# EAGLE design carrier_sengi (EAGLE 9.2.2)
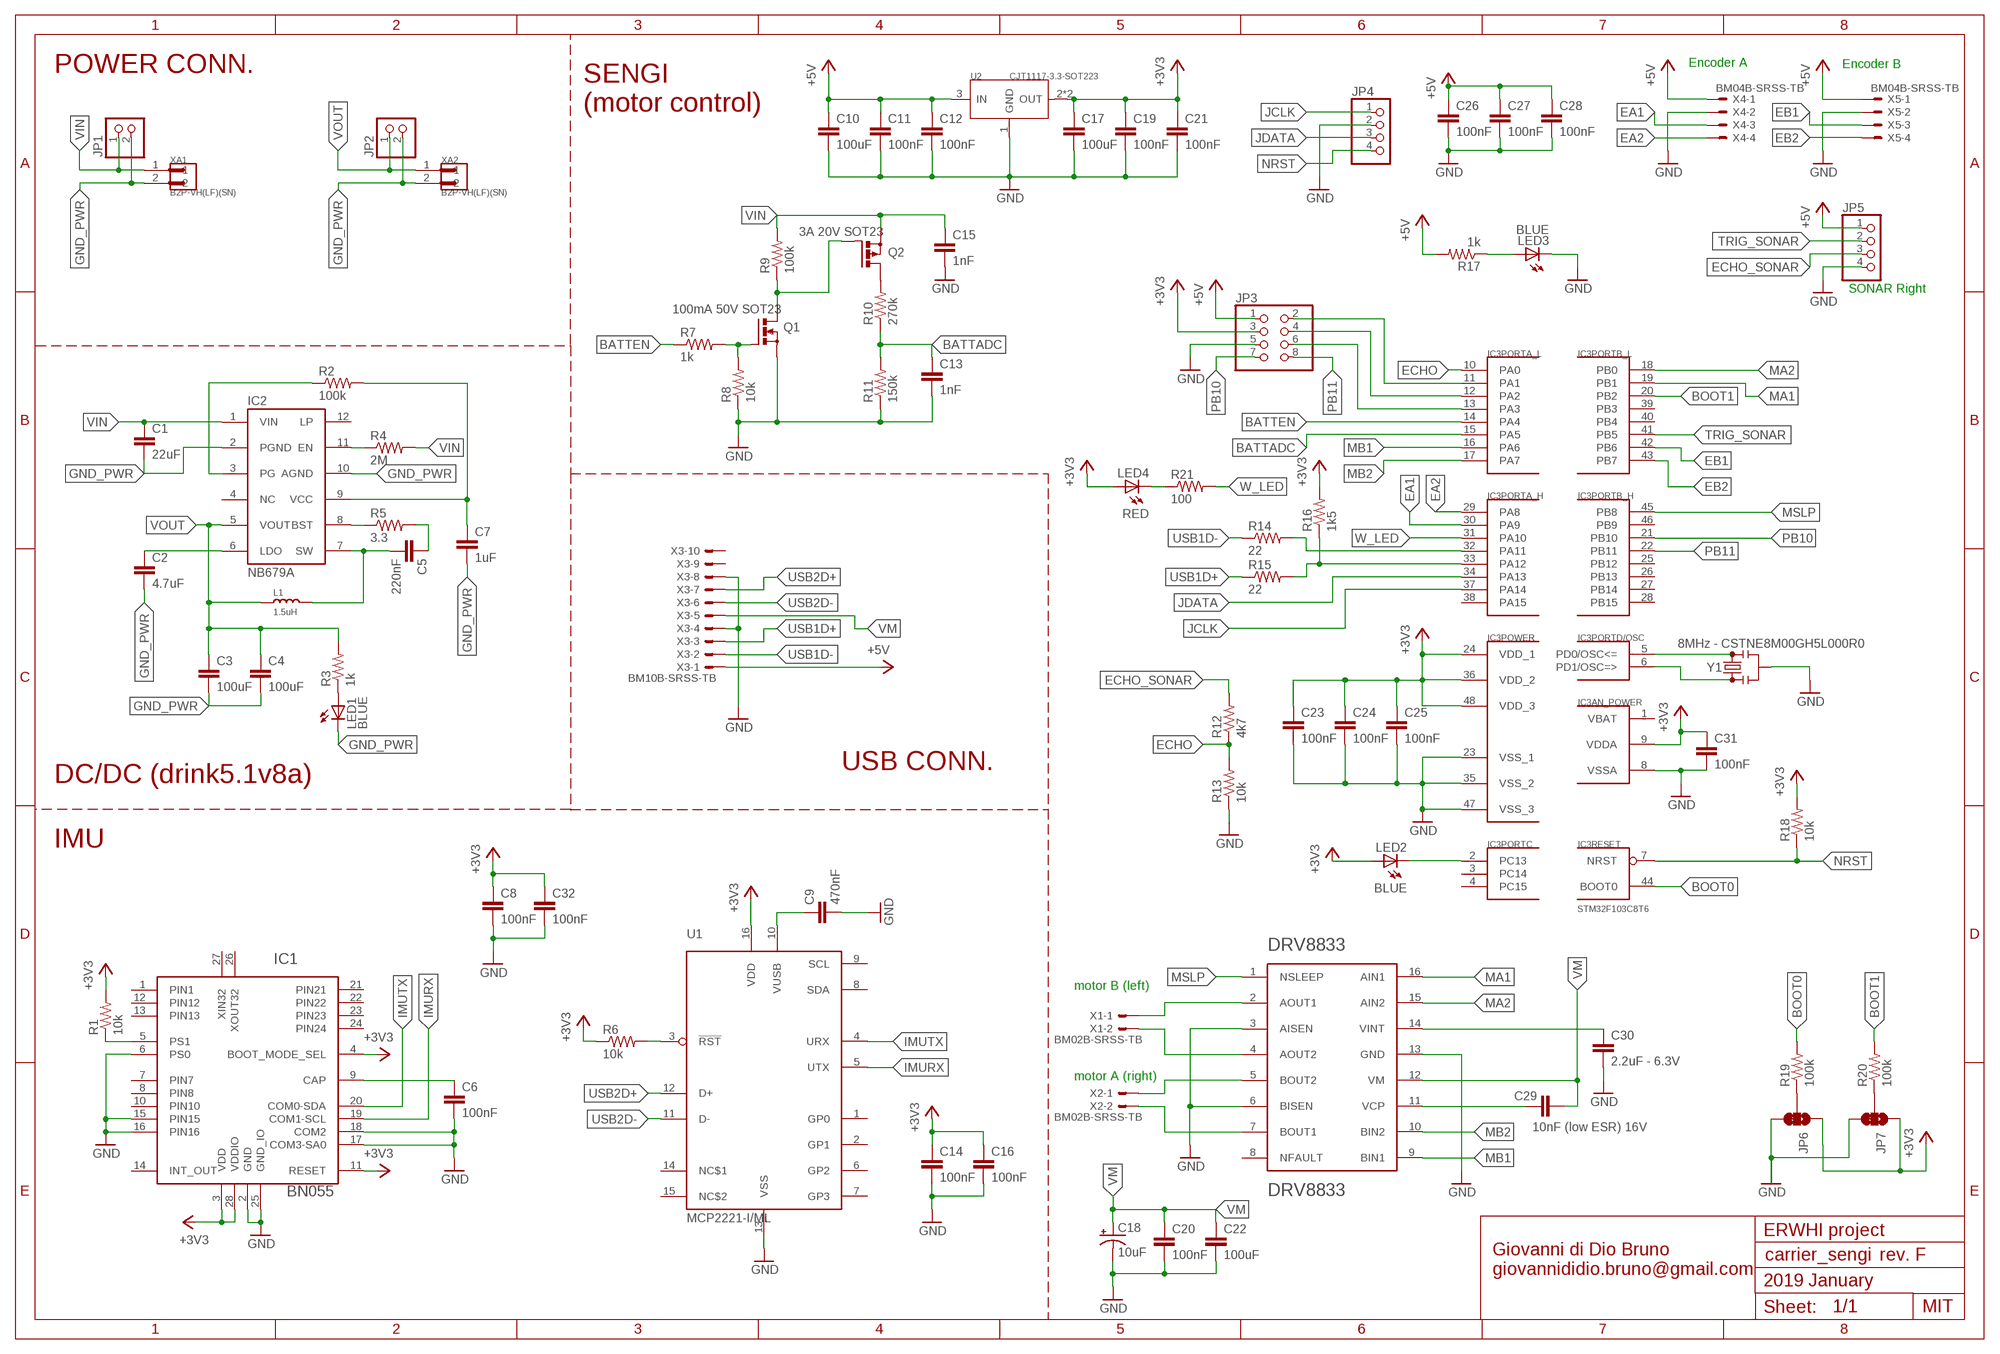
[diagram p0: schematic, sheet 1]

## Parts
C1  22uF  C-EUC0805  [C0805]
C2  4.7uF  C-EUC0603  [C0603]
C3  100uF  C-EUC0805  [C0805]
C4  100uF  C-EUC0805  [C0805]
C5  220nF  C-EUC0603  [C0603]
C6  100nF  C-EUC0402  [C0402]
C7  1uF  C-EUC0603  [C0603]
C8  100nF  C-EUC0402  [C0402]
C9  470nF  C-EUC0402  [C0402]
C10  100uF  C-EUC0603  [C0603]
C11  100nF  C-EUC0402  [C0402]
C12  100nF  C-EUC0402  [C0402]
C13  1nF  C-EUC0402  [C0402]
C14  100nF  C-EUC0402  [C0402]
C15  1nF  C-EUC0402  [C0402]
C16  100nF  C-EUC0402  [C0402]
C17  100uF  C-EUC0603  [C0603]
C18  10uF  10UF-POLAR-EIA3216-16V-10%(TANT)  [EIA3216]
C19  100nF  C-EUC0402  [C0402]
C20  100nF  C-EUC0402  [C0402]
C21  100nF  C-EUC0402  [C0402]
C22  100uF  C-EUC0603  [C0603]
C23  100nF  C-EUC0402  [C0402]
C24  100nF  C-EUC0402  [C0402]
C25  100nF  C-EUC0402  [C0402]
C26  100nF  C-EUC0402  [C0402]
C27  100nF  C-EUC0402  [C0402]
C28  100nF  C-EUC0402  [C0402]
C29  10nF (low ESR) 16V  C-EUC0402  [C0402]
C30  2.2uF - 6.3V  C-EUC0402  [C0402]
C31  100nF  C-EUC0402  [C0402]
C32  100nF  C-EUC0402  [C0402]
IC1  BN055  1658_BNO055  [LGA-28_3.80X5.20/0.5]
IC2  NB679A  [QFN12_2X3]
IC3  STM32F103C8T6  STM32F10XCXT6  [TQFP48]
IC4  DRV8833PWP  DRV8833  [SOP65P640X120-17N]
JP1  PINHD-1X2  [1X02]
JP2  PINHD-1X2  [1X02]
JP3  PINHD-2X4  [2X04]
JP4  PINHD-1X4  [1X04]
JP5  PINHD-1X4  [1X04]
JP6  JUMPER-SMT_3_1-NC_TRACE_NO-SILK  [SMT-JUMPER_3_1-NC_TRACE_NO-SILK]
JP7  JUMPER-SMT_3_1-NC_TRACE_NO-SILK  [SMT-JUMPER_3_1-NC_TRACE_NO-SILK]
L1  1.5uH  SMD-INDUCTOR-10UH-20%(2P-6X6MM)'0630'  [SMD-2P-L6.0XW6.0XH3.0MM]
LED1  BLUE  LEDCHIP-LED0603  [CHIP-LED0603]
LED2  BLUE  LEDCHIP-LED0603  [CHIP-LED0603]
LED3  BLUE  LEDCHIP-LED0603  [CHIP-LED0603]
LED4  RED  LEDCHIP-LED0603  [CHIP-LED0603]
Q1  100mA 50V SOT23  IRLML6344  [SOT-23]
Q2  3A 20V SOT23  IRLML6402  [SOT-23]
R1  10k  R-US_R0402  [R0402]
R2  100k  R-US_R0402  [R0402]
R3  1k  R-US_R0402  [R0402]
R4  2M  R-US_R0603  [R0603]
R5  3.3  R-US_R0603  [R0603]
R6  10k  R-US_R0402  [R0402]
R7  1k  R-US_R0402  [R0402]
R8  10k  R-US_R0402  [R0402]
R9  100k  R-US_R0402  [R0402]
R10  270k  R-US_R0402  [R0402]
R11  150k  R-US_R0402  [R0402]
R12  4k7  R-US_R0402  [R0402]
R13  10k  R-US_R0402  [R0402]
R14  22  R-US_R0402  [R0402]
R15  22  R-US_R0402  [R0402]
R16  1k5  R-US_R0402  [R0402]
R17  1k  R-US_R0402  [R0402]
R18  10k  R-US_R0402  [R0402]
R19  100k  R-US_R0402  [R0402]
R20  100k  R-US_R0402  [R0402]
R21  100  R-US_R0402  [R0402]
U1  MCP2221-I/ML  [QFN16-4X4]
U2  CJT1117-3.3-SOT223  PMIC-CJT1117-3.3(SOT223)  [SOT-223]
X1  BM02B-SRSS-TB  [BM02B-SRSS-TB]
X2  BM02B-SRSS-TB  [BM02B-SRSS-TB]
X3  BM10B-SRSS-TB  [BM10B-SRSS-TB]
X4  BM04B-SRSS-TB  [BM04B-SRSS-TB]
X5  BM04B-SRSS-TB  [BM04B-SRSS-TB]
XA1  B2P-VH(LF)(SN)  [JST_B2P-VH(LF)(SN)]
XA2  B2P-VH(LF)(SN)  [JST_B2P-VH(LF)(SN)]
Y1  8MHz - CSTNE8M00GH5L000R0  RESONATOR-8MHZSMD_3.2X1.3  [RESONATOR-SMD-3.2X1.3]

## Nets
+3V3: C8.1 C14.1 C16.1 C17.1 C19.1 C21.1 C23.1 C24.1 C25.1 C31.1 C32.1 IC1.3(VDD) IC1.4(BOOT_MODE_SEL) IC1.11(RESET) IC1.28(VDDIO) IC3.9(AN_POWER:VDDA) IC3.24(POWER:VDD_1) IC3.36(POWER:VDD_2) IC3.48(POWER:VDD_3) JP3.3 JP6.1 JP7.1 LED2.A LED4.A R1.2 R6.1 R16.2 R18.2 U1.16(VDD) U2.2(OUT) U2.TER(OUT)
+5V: C10.1 C11.1 C12.1 C26.1 C27.1 C28.1 JP3.1 JP5.1 R17.2 U2.3(IN) X3.1 X4.1 X5.1
BATTADC: C13.1 IC3.15(PORTA_L:PA5) R10.1 R11.2
BATTEN: IC3.14(PORTA_L:PA4) R7.1
BOOT0: IC3.44(RESET:BOOT0) R19.2
BOOT1: IC3.20(PORTB_L:PB2) R20.2
EA1: IC3.30(PORTA_H:PA9) X4.3
EA2: IC3.29(PORTA_H:PA8) X4.4
EB1: IC3.42(PORTB_L:PB6) X5.3
EB2: IC3.43(PORTB_L:PB7) X5.4
ECHO: IC3.10(PORTA_L:PA0) R12.1 R13.2
ECHO_SONAR: JP5.3 R12.2
GND: C6.2 C8.2 C9.2 C10.2 C11.2 C12.2 C13.2 C14.2 C15.2 C16.2 C17.2 C18.- C19.2 C20.2 C21.2 C22.2 C23.2 C24.2 C25.2 C26.2 C27.2 C28.2 C30.2 C31.2 C32.2 IC1.2(GND) IC1.6(PS0) IC1.15(PIN15) IC1.16(PIN16) IC1.17(COM3-SA0) IC1.18(COM2) IC1.25(GND_IO) IC3.8(AN_POWER:VSSA) IC3.23(POWER:VSS_1) IC3.35(POWER:VSS_2) IC3.47(POWER:VSS_3) IC4.3(AISEN) IC4.6(BISEN) IC4.13(GND) JP3.5 JP4.2 JP5.4 JP6.3 JP7.3 LED3.C Q1.P2(S) R8.1 R11.1 R13.1 U1.13(VSS) U2.1(GND) X3.4 X3.8 X4.2 X5.2 Y1.2
GND_PWR: C1.2 C2.2 C3.2 C4.2 C7.2 IC2.2(PGND) IC2.10(AGND) JP1.2 JP2.2 LED1.C XA1.2 XA2.2
IMURX: IC1.19(COM1-SCL) U1.5(UTX)
IMUTX: IC1.20(COM0-SDA) U1.4(URX)
JCLK: IC3.37(PORTA_H:PA14) JP4.1
JDATA: IC3.34(PORTA_H:PA13) JP4.3
MA1: IC3.19(PORTB_L:PB1) IC4.16(AIN1)
MA2: IC3.18(PORTB_L:PB0) IC4.15(AIN2)
MB1: IC3.16(PORTA_L:PA6) IC4.9(BIN1)
MB2: IC3.17(PORTA_L:PA7) IC4.10(BIN2)
MSLP: IC3.45(PORTB_H:PB8) IC4.1(NSLEEP)
N$1: IC3.5(PORTD/OSC:PD0/OSC<=) Y1.3
N$2: IC3.6(PORTD/OSC:PD1/OSC=>) Y1.1
N$3: JP6.2 R19.1
N$4: LED4.C R21.1
N$5: IC3.32(PORTA_H:PA11) R14.2
N$6: IC3.33(PORTA_H:PA12) R15.2 R16.1
N$7: JP7.2 R20.1
N$8: IC3.2(PORTC:PC13) LED2.C
N$9: IC4.2(AOUT1) X1.1
N$11: IC4.4(AOUT2) X1.2
N$12: IC4.5(BOUT2) X2.1
N$13: IC4.7(BOUT1) X2.2
N$14: C30.1 IC4.14(VINT)
N$15: C29.2 IC4.11(VCP)
N$16: LED3.A R17.1
N$17: IC3.11(PORTA_L:PA1) JP3.2
N$18: IC3.12(PORTA_L:PA2) JP3.4
N$19: IC3.13(PORTA_L:PA3) JP3.6
N$20: C6.1 IC1.9(CAP)
N$21: IC1.5(PS1) R1.1
N$23: C9.1 U1.10(VUSB)
N$26: R6.2 U1.3(!RST)
N$27: IC2.11(EN) R4.1
N$28: IC2.3(PG) R2.1
N$29: C2.1 IC2.6(LDO)
N$30: IC2.8(BST) R5.1
N$31: C5.1 R5.2
N$32: C5.2 IC2.7(SW) L1.2
N$33: C7.1 IC2.9(VCC) R2.2
N$37: LED1.A R3.1
N$40: Q1.P1(G) R7.2 R8.2
N$41: Q2.P3(D) R10.2
N$46: Q1.P3(D) Q2.P1(G) R9.1
NRST: IC3.7(RESET:NRST) JP4.4 R18.1
PB10: IC3.21(PORTB_H:PB10) JP3.7
PB11: IC3.22(PORTB_H:PB11) JP3.8
TRIG_SONAR: IC3.41(PORTB_L:PB5) JP5.2
USB1D+: R15.1 X3.3
USB1D-: R14.1 X3.2
USB2D+: U1.12(D+) X3.7
USB2D-: U1.11(D-) X3.6
VIN: C1.1 C15.1 IC2.1(VIN) JP1.1 Q2.P2(S) R4.2 R9.2 XA1.1
VM: C18.+ C20.1 C22.1 C29.1 IC4.12(VM) X3.5
VOUT: C3.1 C4.1 IC2.5(VOUT) JP2.1 L1.1 R3.2 XA2.1
W_LED: IC3.31(PORTA_H:PA10) R21.2
Unconnected: IC1.1(PIN1) IC1.7(PIN7) IC1.8(PIN8) IC1.10(PIN10) IC1.12(PIN12) IC1.13(PIN13) IC1.14(INT_OUT) IC1.21(PIN21) IC1.22(PIN22) IC1.23(PIN23) IC1.24(PIN24) IC1.26(XOUT32) IC1.27(XIN32) IC2.4(NC) IC2.12(LP) IC3.3(PORTC:PC14) IC3.4(PORTC:PC15) IC3.25(PORTB_H:PB12) IC3.26(PORTB_H:PB13) IC3.27(PORTB_H:PB14) IC3.28(PORTB_H:PB15) IC3.38(PORTA_H:PA15) IC3.39(PORTB_L:PB3) IC3.40(PORTB_L:PB4) IC3.46(PORTB_H:PB9) IC4.8(NFAULT) U1.1(GP0) U1.2(GP1) U1.6(GP2) U1.7(GP3) U1.8(SDA) U1.9(SCL) U1.14(NC$1) U1.15(NC$2) X3.9 X3.10

## Notes on the sheet
- Encoder A | Encoder B
- POWER CONN.
- SENGI
  (motor control)
- SONAR Right
- USB CONN.
- DC/DC (drink5.1v8a)
- IMU
- motor B (left)
- motor A (right)
- ERWHI project
- rev. F
- Giovanni di Dio Bruno
  giovannididio.bruno@gmail.com
- 2019 January
- MIT

## Power pins joined to a net without a drawn wire
VBAT: IC3.1(AN_POWER:VBAT)

## Library data of the parts
C1-C17 C19-C32 = resistor:C-EU: CAPACITOR, European symbol
C18 = SparkFun-Capacitors:10UF-POLAR: 10.0µF polarized capacitors A capacitor is a passive two-terminal electrical component used to store electrical energy temporarily in an electric field.; PROD_ID: CAP-00811
IC1 = BNO055:1658_BNO055: BN055 Intelligent 9-axis absolute orientation sensor; PART_NUMBER: BNO055
IC2 = my03:NB679A: NB679A 5.1V 8A step down
IC3 = stm32:STM32F10XCXT6: ST STM32F101/103 48pin LQFP
IC4 = DRV8833PWP:DRV8833
JP1 JP2 = pinhead:PINHD-1X2: PIN HEADER
JP3 = pinhead:PINHD-2X4: PIN HEADER
JP4 JP5 = pinhead:PINHD-1X4: PIN HEADER
JP6 JP7 = SparkFun-Jumpers:JUMPER-SMT_3_1-NC_TRACE: Normally closed trace jumper (1 of 2 connections) This jumper has a trace between two pads so it's normally closed (NC). The other connection is normally open (NO). Use a razor knife to open the connection. For best results follow the IPC guidelines for cutting traces: Cutout at least 0.063 mm (0.005 in). Remove all loose material to clean up the cut area. Seal the cut with an approved epoxy. Reapply solder to reclose the connection, or to close the NO connection.
L1 = Seeed-Inductor:SMD-INDUCTOR-10UH-20%(2P-6X6MM): 303010016; MPN: CSAB0630-100M; VALUE: 10UH
LED1-LED4 = led:LED: LED OSRAM: - CHIPLED LG R971, LG N971, LY N971, LG Q971, LY Q971, LO R971, LY R971 LH N974, LH R974 LS Q976, LO Q976, LY Q976 LO Q996 - Hyper CHIPLED LW Q18S LB Q993, LB Q99A, LB R99A - SideLED LS A670, LO A670, LY A670, LG A670, LP A670 LB A673, LV A673, LT A673, LW A673 LH A674 LY A675 LS A676, LA A676, LO A676, LY A676, LW A676 LS A679, LY A679, LG A679 - Hyper Micro SIDELED® LS Y876, LA Y876, LO Y876, LY Y876 LT Y87S - SmartLED LW L88C, LW L88S LB L89C, LB L89S, LG L890 LS L89K, LO L89K, LY L89K LS L896, LA L896, LO L896, LY L896 - TOPLED LS T670, LO T670, LY T670, LG T670, LP T670 LSG T670, LSP T670, LSY T670, LOP T670, LYG T670 LG T671, LOG T671, LSG T671 LB T673, LV T673, LT T673, LW T673 LH T674 LS T676, LA T676, LO T676, LY T676, LB T676, LH T676, LSB T676, LW T676 LB T67C, LV T67C, LT T67C, LS T67K, LO T67K, LY T67K, LW E67C LS E67B, LA E67B, LO E67B, LY E67B, LB E67C, LV E67C, LT E67C LW T67C LS T679, LY T679, LG T679 LS T770, LO T770, LY T770, LG T770, LP T770 LB T773, LV T773, LT T773, LW T773 LH T774 LS E675, LA E675, LY E675, LS T675 LS T776, LA T776, LO T776, LY T776, LB T776 LHGB T686 LT T68C, LB T68C - Hyper Mini TOPLED® LB M676 - Mini TOPLED Santana® LG M470 LS M47K, LO M47K, LY M47K Source: http://www.osram.convergy.de LUXEON: - LUMILED® LXK2-PW12-R00, LXK2-PW12-S00, LXK2-PW14-U00, LXK2-PW14-V00 LXK2-PM12-R00, LXK2-PM12-S00, LXK2-PM14-U00 LXK2-PE12-Q00, LXK2-PE12-R00, LXK2-PE12-S00, LXK2-PE14-T00, LXK2-PE14-U00 LXK2-PB12-K00, LXK2-PB12-L00, LXK2-PB12-M00, LXK2-PB14-N00, LXK2-PB14-P00, LXK2-PB14-Q00 LXK2-PR12-L00, LXK2-PR12-M00, LXK2-PR14-Q00, LXK2-PR14-R00 LXK2-PD12-Q00, LXK2-PD12-R00, LXK2-PD12-S00 LXK2-PH12-R00, LXK2-PH12-S00 LXK2-PL12-P00, LXK2-PL12-Q00, LXK2-PL12-R00 Source: www.luxeon.com KINGBRIGHT: KA-3528ASYC Source: www.kingbright.com
Q1 = mosfet:IRLML6344: Nch MOSFET IRLML6344 30V 5A http://akizukidenshi.com/catalog/g/gI-06049/ I-06049
Q2 = mosfet:IRLML6402: Pch MOSFET IRLML6402 20V 3.7A http://akizukidenshi.com/catalog/g/gI-02553/ I-02553
R1-R21 = resistor:R-US_: RESISTOR, American symbol
U1 = microchip-mcp2221:MCP2221-I/ML: MCP2221 in QFN package The MCP2221 is a USB-to-UART/I2C serial converter which enables USB connectivity in applications that have a UART and I2C interfaces. The device reduces external components by integrating the USB termination resistors and the oscillator needed for USB operation. The MCP2221 also has four GP pins providing miscellaneous functionalities (GPIO, USBCFG, SSPND, Clock Output, ADC, DAC, interrupt detector). Source: www.microchip.com/MCP2221 <http://www.microchip.com/wwwproducts/Devices.aspx?product=MCP2221> and www.microchipdirect.com <http://www.microchipdirect.com/ProductDetails.aspx?Category=MCP2221> Tutorial: MCP2221 by Arnauld Biganzoli <https://docs.google.com/document/d/1P3zzqCKdEXzCe--1Yyg8PClCZKsUri8pyNO7AV2daaw/edit?usp=sharing>
U2 = Seeed-IC:PMIC-CJT1117-3.3(SOT223): 310030097; MPN: CJT1117-3.3
X1 X2 = con-jst2:?M02B-SRSS-TB: Disconnectable Crimp style connector, 1.0mm pitch 2 contacts
X3 = con-jst2:?M10B-SRSS-TB: Disconnectable Crimp style connector, 1.0mm pitch 10 contacts
X4 X5 = con-jst2:?M04B-SRSS-TB: Disconnectable Crimp style connector, 1.0mm pitch 4 contacts
XA1 XA2 = B2P-VH_LF__SN_:B2P-VH(LF)(SN): VH Series 3.96 mm Pitch, Compact, Lock Mechanism also Prevents Misinsertion; AVAILABILITY: Good; DESCRIPTION: VH Series 3.96 mm Pitch, Compact, Lock Mechanism also Prevents Misinsertion; MF: JST; MP: B2P-VH_LF__SN_; PACKAGE: FakePackage u; PRICE: 0.09 USD
Y1 = SparkFun-Clocks:RESONATOR-8MHZ: 8MHz Resonator Digikey Example <http://www.digikey.com/product-detail/en/murata-electronics-north-america/CSTCE10M0G55-R0/490-1196-1-ND/584633> Frequency: 8MHz Frequency Stability: ±0.2% Frequency Tolerance: ±0.5% Capacitance: 33pF SparkFun Products Arduino Pro Mini 328- 3.3V/8MHz <https://www.sparkfun.com/products/11114> SparkFun Digital Sandbox <https://www.sparkfun.com/products/12651>; PROD_ID: XTAL-08895; VALUE: 8MHz

## Board
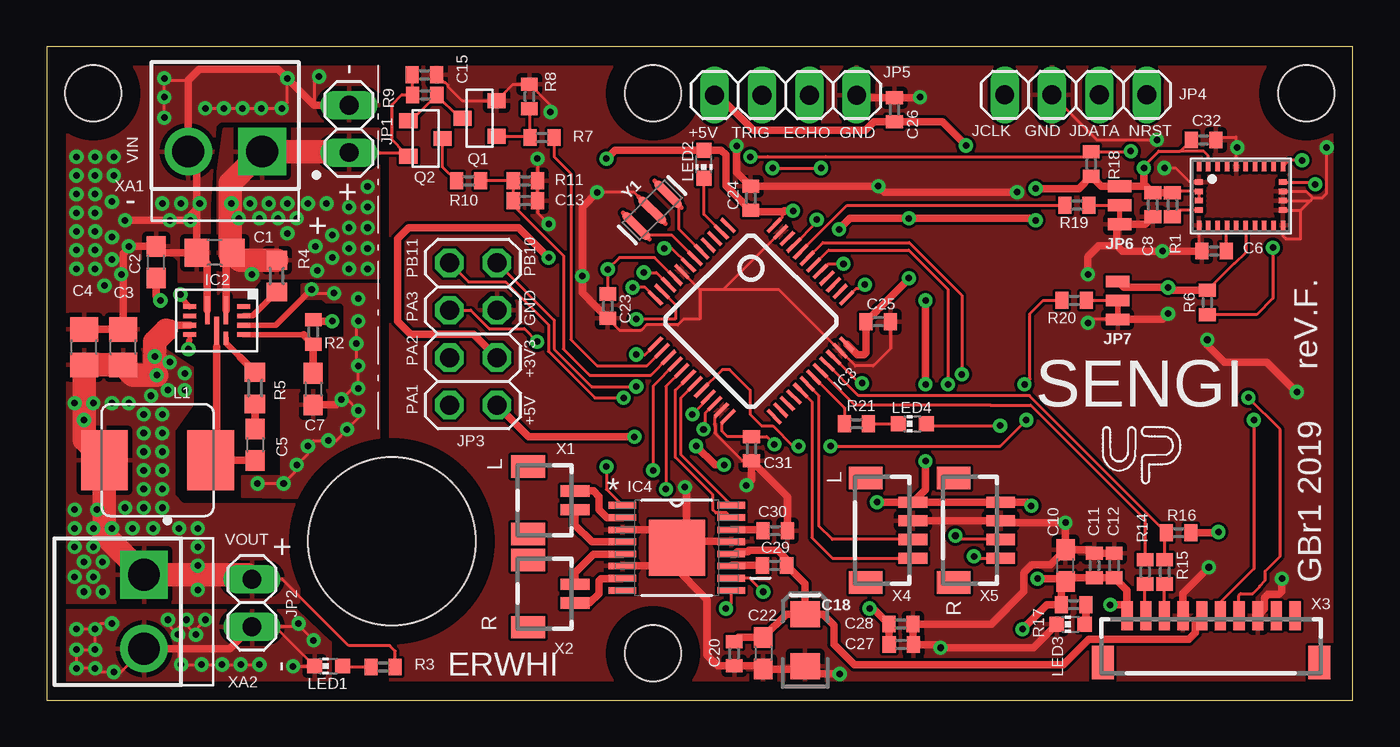
[diagram p1: board, top side]
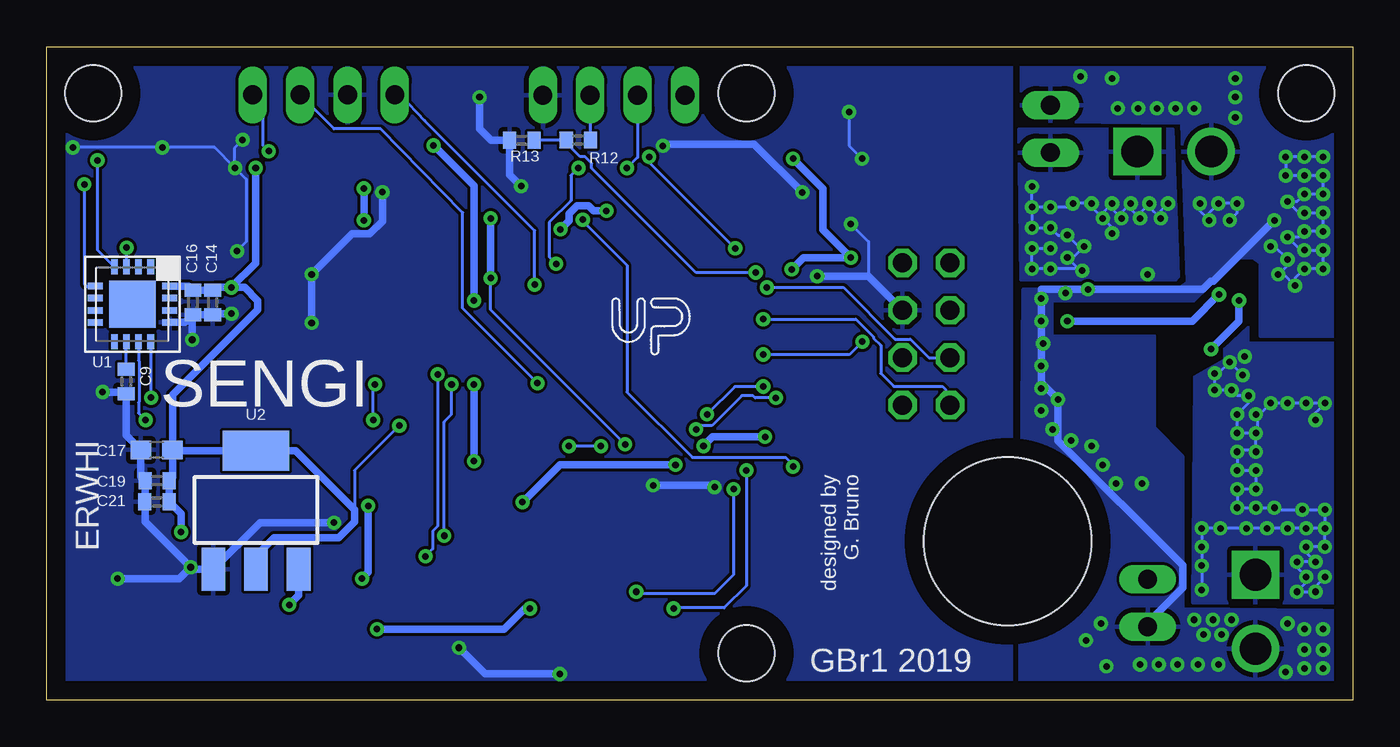
[diagram p2: board, bottom side, seen from below]

Size 70 x 35 mm. Coordinates in mm from the lower left corner, seen from the top.
Outline: 0,0 70,0 70,35 0,35 0,0
Copper layers (1*16): Top 0.035mm / dielectric 1.5mm / Bottom 0.035mm
Design rules "default": minimum track width 6mil, minimum drill 0.35mm, track to track 6mil, track to pad 6mil, pad to pad 6mil, via to via 6mil, smd to smd 6mil, copper to edge 40mil, drill to drill 6mil, minimum pad ring 10mil, minimum via ring 8mil, stop-mask expansion 4mil, vias tented up to drill 0mil, thermal gap 10mil
Holes 3 mm at 32.5,2.5 67.5,32.5 32.5,32.5 2.5,32.5
Holes 9 mm at 18.5,8.5

### Footprints (pad centres in the part's own frame; a part is rotated, then mirrored left to right if it is on the bottom)
C0805 = smd 1.3 x 1.5: 1 -0.95,0; 2 0.95,0
C0603 = smd 1.1 x 1: 1 -0.85,0; 2 0.85,0
C0402 = smd 0.7 x 0.9: 1 -0.65,0; 2 0.65,0
EIA3216 = smd 1.4 x 1.6: + 1.4,0; - -1.4,0
LGA-28_3.80X5.20/0.5 = smd 0.3 x 0.5: 1 -2.25,1.56; 6 -2.25,-1.56; 7 -1.75,-1.56; 8 -1.25,-1.56; 9 -0.75,-1.56; 10 -0.25,-1.56; 11 0.25,-1.56; 12 0.75,-1.56; 13 1.25,-1.56; 14 1.75,-1.56; 15 2.25,-1.56; 20 2.25,1.56; 21 1.75,1.56; 22 1.25,1.56; 23 0.75,1.56; 24 0.25,1.56; 25 -0.25,1.56; 26 -0.75,1.56; 27 -1.25,1.56; 28 -1.75,1.56 | smd 0.5 x 0.3: 2 -2.25,0.75; 3 -2.25,0.25; 4 -2.25,-0.25; 5 -2.25,-0.75; 16 2.25,-0.75; 17 2.25,-0.25; 18 2.25,0.25; 19 2.25,0.75
QFN12_2X3 = smd 1.5 x 0.25: 1 -0.55,0.5; 2 -0.55,-0.5; 7 0.55,0 | smd 0.25 x 0.7: 3 -0.75,-1.45; 4 -0.25,-1.45; 5 0.25,-1.45; 6 0.75,-1.45; 9 0.75,1.45; 10 0.25,1.45; 11 -0.25,1.45; 12 -0.75,1.45 | smd 0.7 x 0.25: 8 0.95,0.5
TQFP48 = smd 0.2 x 1: 1 -2.75,-4.5; 2 -2.25,-4.5; 3 -1.75,-4.5; 4 -1.25,-4.5; 5 -0.75,-4.5; 6 -0.25,-4.5; 7 0.25,-4.5; 8 0.75,-4.5; 9 1.25,-4.5; 10 1.75,-4.5; 11 2.25,-4.5; 12 2.75,-4.5; 25 2.75,4.5; 26 2.25,4.5; 27 1.75,4.5; 28 1.25,4.5; 29 0.75,4.5; 30 0.25,4.5; 31 -0.25,4.5; 32 -0.75,4.5; 33 -1.25,4.5; 34 -1.75,4.5; 35 -2.25,4.5; 36 -2.75,4.5 | smd 1 x 0.2: 13 4.5,-2.75; 14 4.5,-2.25; 15 4.5,-1.75; 16 4.5,-1.25; 17 4.5,-0.75; 18 4.5,-0.25; 19 4.5,0.25; 20 4.5,0.75; 21 4.5,1.25; 22 4.5,1.75; 23 4.5,2.25; 24 4.5,2.75; 37 -4.5,2.75; 38 -4.5,2.25; 39 -4.5,1.75; 40 -4.5,1.25; 41 -4.5,0.75; 42 -4.5,0.25; 43 -4.5,-0.25; 44 -4.5,-0.75; 45 -4.5,-1.25; 46 -4.5,-1.75; 47 -4.5,-2.25; 48 -4.5,-2.75
SOP65P640X120-17N = smd 1.473 x 0.356: 1 -2.921,2.286; 2 -2.921,1.626; 3 -2.921,0.965; 4 -2.921,0.33; 5 -2.921,-0.33; 6 -2.921,-0.965; 7 -2.921,-1.626; 8 -2.921,-2.286; 9 2.921,-2.286; 10 2.921,-1.626; 11 2.921,-0.965; 12 2.921,-0.33; 13 2.921,0.33; 14 2.921,0.965; 15 2.921,1.626; 16 2.921,2.286 | smd 2.997 x 2.997: 17 0,0
1X02 = drill 1.016 long: 1 -1.27,0; 2 1.27,0
2X04 = drill 1.016 octagon: 1 -3.81,-1.27; 2 -3.81,1.27; 3 -1.27,-1.27; 4 -1.27,1.27; 5 1.27,-1.27; 6 1.27,1.27; 7 3.81,-1.27; 8 3.81,1.27
1X04 = drill 1.016 long: 1 -3.81,0; 2 -1.27,0; 3 1.27,0; 4 3.81,0
SMT-JUMPER_3_1-NC_TRACE_NO-SILK = smd 0.635 x 1.27: 1 -1.016,0; 2 0,0; 3 1.016,0
SMD-2P-L6.0XW6.0XH3.0MM = smd 2.5 x 3.2: 1 -2.85,0; 2 2.85,0
CHIP-LED0603 = smd 0.8 x 0.8: A 0,-0.75; C 0,0.75
SOT-23 = smd 0.802 x 0.972: P1 -0.95,-0.917; P2 0.95,-0.917; P3 0,0.917
R0402 = smd 0.7 x 0.9: 1 -0.65,0; 2 0.65,0
R0603 = smd 1 x 1.1: 1 -0.85,0; 2 0.85,0
QFN16-4X4 = smd 0.8 x 0.35: 1 -2,0.975; 2 -2,0.325; 3 -2,-0.325; 4 -2,-0.975; 9 2,-0.975; 10 2,-0.325; 11 2,0.325; 12 2,0.975 | smd 0.35 x 0.8: 5 -0.975,-2; 6 -0.325,-2; 7 0.325,-2; 8 0.975,-2; 13 0.975,2; 14 0.325,2; 15 -0.325,2; 16 -0.975,2 | smd 2.5 x 2.5: EXP 0,0
SOT-223 = smd 1.27 x 2.286: 1 -2.286,-3.175; 2 0,-3.175; 3 2.286,-3.175 | smd 3.556 x 2.159: TER 0,3.175
BM02B-SRSS-TB = smd 0.6 x 1.55: 1 0.5,-1.625; 2 -0.5,-1.625 | smd 1.2 x 1.8: FIT@1 1.8,0.9; FIT@2 -1.8,0.9
BM10B-SRSS-TB = smd 0.6 x 1.55: 1 4.5,-1.625; 2 3.5,-1.625; 3 2.5,-1.625; 4 1.5,-1.625; 5 0.5,-1.625; 6 -0.5,-1.625; 7 -1.5,-1.625; 8 -2.5,-1.625; 9 -3.5,-1.625; 10 -4.5,-1.625 | smd 1.2 x 1.8: FIT@1 5.8,0.9; FIT@2 -5.8,0.9
BM04B-SRSS-TB = smd 0.6 x 1.55: 1 1.5,-1.625; 2 0.5,-1.625; 3 -0.5,-1.625; 4 -1.5,-1.625 | smd 1.2 x 1.8: FIT@1 2.8,0.9; FIT@2 -2.8,0.9
JST_B2P-VH(LF)(SN) = drill 1.7 square: 1 -1.98,0 | drill 1.7: 2 1.98,0
RESONATOR-SMD-3.2X1.3 = smd 0.45 x 1.905: 1 -1.2,0; 2 0,0; 3 1.2,0

### Placement (x,y rotation side)
C1  9,23.97 180 top
C2  5.87,23.45 90 top
C3  4.1,18.9 90 top
C4  2,18.9 90 top
C5  11.17,13.68 270 top
C6  62.56,24.05 180 top
C7  14.29,16.65 270 top
C8  59.27,26.53 270 top
C9  65.73,17.06 270 bottom
C10  54.6,7.2 90 top
C11  56.15,7.21 90 top
C12  57.21,7.21 90 top
C13  25.66,26.75 0 top
C14  61.1,21.3 270 bottom
C15  20.24,33.49 0 top
C16  62.16,21.3 270 bottom
C17  64.1,13.4 180 bottom
C18  40.65,3.2 90 top
C19  64.08,11.75 180 bottom
C20  36.85,2.48 270 top
C21  64.09,10.61 180 bottom
C22  38.4,2.5 270 top
C23  30.07,21.1 270 top
C24  37.73,26.88 90 top
C25  44.56,20.27 0 top
C26  45.43,31.62 90 top
C27  45.8,2.97 0 top
C28  45.78,4.07 0 top
C29  39.01,7.21 180 top
C30  39.04,9.07 0 top
C31  37.77,13.46 270 top
C32  62,30 0 top
IC1  64,27 0 top
IC2  9.11,20.33 270 top
IC3  37.75,20.3 225 top
IC4  33.77,8.15 0 top
JP1  16.2,30.6 90 top
JP2  11,5.2 270 top
JP3  22.86,19.61 90 top
JP4  55.15,32.42 0 top
JP5  39.6,32.4 0 top
JP6  57.5,26.5 270 top
JP7  57.4,21.4 270 top
L1  5.94,12.85 0 top
LED1  15.1,1.82 90 top
LED2  35.22,28.7 180 top
LED3  54.88,4.06 90 top
LED4  46.4,14.8 90 top
Q1  23.2,31.16 90 top
Q2  20.3,30.08 270 top
R1  60.33,26.53 90 top
R2  14.29,19.71 270 top
R3  18.03,1.77 0 top
R4  12.33,22.71 90 top
R5  11.17,16.71 270 top
R6  62.2,21.3 270 top
R7  26.55,30.13 180 top
R8  25.87,32.33 270 top
R9  20.26,32.41 180 top
R10  22.61,27.81 180 top
R11  25.66,27.81 180 top
R12  41.5,30 0 bottom
R13  44.54,29.99 0 bottom
R14  58.86,6.86 90 top
R15  59.91,6.86 90 top
R16  60.66,8.96 0 top
R17  55.04,5.1 180 top
R18  55.97,28.71 270 top
R19  55.21,26.51 180 top
R20  55.06,21.41 180 top
R21  43.4,14.8 180 top
U1  65.4,21.2 270 bottom
U2  58.78,10.18 0 bottom
U$1  [LOGO_UP]  56.6,11.4 0 top
U$2  [LOGO_UP]  39.7,18.3 0 bottom
X1  26.7,10.7 90 top
X2  26.7,5.7 90 top
X3  62.4,2.9 180 top
X4  44.8,9.1 90 top
X5  49.5,9.1 90 top
XA1  9.57,29.38 180 top
XA2  5.22,4.73 270 top
Y1  32.45,26.24 45 top

### Tracks (layer width: path | path; a pad name or v marks a point on that pad's centre or on a via)
+3V3  (via drill 0.35)
  Top 0.152: IC3.9 32.58,23.7 30.7,23.7 v30.07,23.07 C23.1 | IC1.4 IC1.3 60.4,27.25 R1.2 | R6.1 63.62,23.37 63.66,23.37 64.25,23.97 IC1.11 | IC1.28 62.25,29.15 62,29.4 60.75,29.4 | v58.8,28.5 58.8,28.6 59.6,29.4 60.75,29.4 | IC3.24 36.2,14.86 36.2,14.4 36.49,14.11 C31.1 38.59,14.11 v39,13.7 | C24.1 37.86,26.1 39.4,26.1 39.4,25.84 IC3.48 | C32.1 60.75,29.4 | LED4.A 47.25,14.7 v51.1,14.7
  Top 0.406: v62.8,9 62.76,8.96 R16.2 | C8.1 58.94,27.52 JP6.1 56.51,27.52 R18.2 55.31,27.4 v53,27.4 | C8.1 R1.2 | JP7.1 57.72,22.1 v60.1,22.1 60.25,21.95 R6.1 | C8.1 58.8,27.66 v58.8,28.5 | v46.2,22.6 46.2,22.56 44.72,21.08 44.71,21.08 44.5,20.87 44.5,20.86 C25.1 43.91,18.61 43.8,18.5 43.44,18.5 IC3.36 | JP3.3 22.87,19.6 19.5,19.6 18.8,20.3 18.8,24.7 19.4,25.3 25.3,25.3 v26.9,23.7 | v30,29 30.45,29.45 LED2.A 36.15,29.45 36.4,29.2 36.4,27.56 37.13,26.82 37.14,26.82 C24.1 37.79,26.17 39.5,26.17 39.54,26.2 v40,26.2 | v42.46,25.21 43.05,25.8 v46.2,25.8 52.9,25.8 v53,25.7
  Bottom 0.152: v39,13.7 46.2,20.9 v46.2,22.6 | v51.1,14.7 53.5,12.3 53.5,10.2
  Bottom 0.406: C17.1 63.2,13.36 U2.TER 56.66,13.36 53.5,10.2 53.5,9.56 54.36,8.7 57.8,8.7 58.78,7.72 U2.2 | C17.1 63.25,11.93 C19.1 63.43,10.62 C21.1 62.8,9.98 v62.8,9 | v60.1,22.1 60.95,22.1 C14.1 C16.1 62.39,22.18 U1.16 | C17.1 63.25,16.35 58.7,20.9 58.7,21.4 59.4,22.1 v60.1,22.1 | v58.8,28.5 58.8,23.4 v60.1,22.1 | v30.07,23.07 29.44,23.7 v26.9,23.7 28.4,25.2 28.4,27.4 v30,29 | v42.46,25.21 42,25.68 42,26.04 41.57,26.47 40.96,26.47 40.69,26.2 v40,26.2 | v53,25.7 v53,27.4 | v46.2,22.6 v46.2,25.8
+5V  (via drill 0.35)
  Top 0.406: C27.1 45.15,4.05 C28.1 44.3,4.9 v44.1,4.9 | C11.1 | C11.1 C12.1 57.9,5.87 57.9,5.1 | 57.9,5.1 X3.1 | C10.1 54.81,6.56 C11.1 | C10.1 54.38,6.13 R17.2 53.6,5.1 v52.3,3.8 | v57,5.1 57.9,5.1 | JP3.1 25.83,14.1 v31.5,14.1 | v34.8,13.61 35.81,12.6 v36.3,12.6 | v44.5,10.6 X4.1 | X4.1 X5.1 52.57,10.6 v52.77,10.4 | JP5.1 35.99,32.4 37.87,30.52 43.87,30.52 44.32,30.97 C26.1 48,30.97 v49.27,29.71 | v47.1,21.4 v47.1,16.91 | v47.1,12.8 47.1,11.28 X4.1 | C10.1 54.45,6.5 v53.1,6.5
  Bottom 0.406: v52.3,3.8 45.5,3.8 44.4,4.9 v44.1,4.9 | U2.3 56.49,5.61 v57,5.1 | v31.5,14.1 34.31,14.1 v34.8,13.61 | v36.3,12.6 42.5,12.6 v44.5,10.6 | v49.27,29.71 47.1,27.54 v47.1,21.4 | v47.1,16.91 v47.1,12.8 | v53.1,6.5 52.77,6.83 v52.77,10.4
BATTADC
  Top 0.152: R10.1 R11.2 C13.1 25.01,26.49 27.7,23.8 27.7,18.8 29.1,17.4 32.38,17.4 IC3.15
BATTEN
  Top 0.152: R7.1 27.2,29.1 28.1,28.2 28.1,19.3 29.5,17.9 32.17,17.9 IC3.14
BOOT0
  Top 0.152: IC3.44 42.89,26.5 R19.2
BOOT1  (via drill 0.35)
  Top 0.152: IC3.20 36.21,17.7 36.6,17.7 37.7,16.6 37.7,15.3 38.31,14.69 38.91,14.69 40,13.6 v40.3,13.6 | R20.2 53.41,21.41 52.7,20.7 52.7,17.21 v52.4,16.91 | v42.01,13.6 51.1,13.6 v52.5,15
  Bottom 0.152: v40.3,13.6 v42.01,13.6 | v52.5,15 52.5,16.81 v52.4,16.91
EA1
  Top 0.152: X4.3 42.1,8.6 41.4,9.3 41.4,16.3 IC3.30
EA2
  Top 0.152: IC3.29 41,15.99 41,8.7 42.1,7.6 X4.4
EB1  (via drill 0.35)
  Top 0.152: IC3.42 41.9,24.1 46.2,24.1 48.3,22 v48.3,16.91 | X5.3 48.9,8.6 v48.7,8.8
  Bottom 0.152: v48.7,8.8 48.7,14.9 48.3,15.3 v48.3,16.91
EB2  (via drill 0.35)
  Top 0.152: IC3.43 41.6,24.5 46.23,24.5 49.05,21.68 v49.05,17.45 | v49.7,7.7 49.8,7.6 X5.4
  Bottom 0.152: v49.05,17.45 49.05,9.31 49.31,9.05 49.31,8.09 v49.7,7.7
ECHO  (via drill 0.35)
  Top 0.152: v32,22.9 32.67,22.9 IC3.10
  Bottom 0.152: R13.2 R12.1 42.15,29.85 41.41,29.11 41.15,29.11 40.79,28.75 40.79,28.49 35.2,22.9 v32,22.9
ECHO_SONAR
  Bottom 0.152: JP5.3 40.87,30.02 R12.2
GND  (via drill 0.35)
  Top 0.152: IC1.6 61.75,24.21 C6.2 | IC1.2 61.25,27.75 60.5,28.5 v59.9,28.5 | C15.2 21.29,33.09 21.36,33.09 21.49,32.95 21.49,32.89 22.27,32.11 Q1.P2 24.99,32.98 R8.1 27,31.85 v27,31.5 | v26.3,29 R11.1 C13.2 26.31,26.09 v26.9,25.5 | IC3.23 35.8,15.17 35.8,14.76 35.81,14.75 35.81,14.29 37.29,12.81 C31.2 | Y1.2 31.49,27.2 v29.5,27.2 | IC3.8 35,21.99 | 35,21.99 35,20.4 34.13,20.4 33.83,20.09 32.15,20.09 31.85,19.79 30.73,19.79 C23.2 | IC3.47 36.26,21.99 | 36.26,21.99 35,21.99 | 36.26,21.99 39.24,21.99 IC3.35 43.33,17.9 44.3,17.9 45.21,18.81 C25.2 | 67.85,26.89 68.35,26.89 68.6,27.14 v68.6,29.6 | 67.85,26.89 67.49,27.25 IC1.18 | IC1.17 67.7,26.75 | 67.7,26.75 67.85,26.89 | IC1.16 67.2,26.25 | 67.2,26.25 67.7,26.75 | IC1.15 66.25,24.85 66.4,24.7 67.2,24.7 67.2,26.25 | IC1.25 63.75,29.55 | 63.75,29.55 63.75,30.15 62.8,30.15 C32.2 | 63.75,29.55 v63.8,29.6 | JP7.3 55.98,20.38 v55.8,20.2 | JP4.2 56.29,30.01 v59.5,30.01
  Top 0.406: X3.4 60.9,5.73 v62.28,7.11 | C8.2 58.88,25.48 JP6.3 57.35,25.34 57.35,24.33 | JP7.3 59.78,20.38 v60.1,20.7 | C12.2 C11.2 55.96,8.05 C10.2 | C6.2 v59.8,24.05 57.63,24.05 57.35,24.33 | 57.35,24.33 56.4,24.33 55.8,23.73 v55.8,22.8 | 40.5,1.65 C22.2 38.22,1.83 C20.2 35.97,1.83 35.4,2.4 35.4,5.37 33.59,7.18 | 40.5,1.65 C18.- | v42.5,1.39 40.76,1.39 40.5,1.65 | v66.2,6.5 66.2,5.83 66.03,5.66 65.45,5.66 65.24,5.45 65.24,4.87 X3.8 | C10.2 v54.6,9.5 51.23,9.5 X5.2 X4.2 | IC4.3 34.28,9.12 | IC4.13 36.67,8.5 34.9,8.5 | 34.28,9.12 34.9,8.5 | IC4.6 33.59,7.18 | 33.59,7.18 34.9,8.5 | C30.2 39.69,10.89 C31.2 37.77,11.77 v37.5,11.5 | 34.28,9.12 34.28,11.31 v34.2,11.4 | C23.2 29.48,21.04 29.47,21.04 28.71,21.81 v28.71,22.71 28.71,26.41 v29.5,27.2 | v67,16.5 65.4,18.1 63.1,18.1 62.2,19 v62.2,19.3 | LED3.C 52.87,2.8 v47.9,2.8 47.73,2.97 C27.2 46.43,2.99 C28.2 50.62,4.07 52.37,5.82 52.37,6.8 52.8,7.23 53.78,7.23 C10.2 | v52.01,27.21 44.89,27.21 v44.57,27.53 C24.2 36.98,28.28 v36.98,29.68 | JP5.4 43.54,32.27 C26.2 46.77,32.27 v46.8,32.3
  Bottom 0.152: v59.8,24.05 59.3,24.55 59.3,27.9 v59.9,28.5 59.95,28.55 | v27,31.5 27,29.7 v26.3,29 | v26.9,25.5 25.96,24.56 25.96,22.71 | v68.6,29.6 v63.8,29.6 61,29.6 59.95,28.55 | v59.5,30.01 59.95,29.56 59.95,28.55
  Bottom 0.406: v62.28,7.11 62.18,7 U2.1 58.57,9.5 v54.6,9.5 | C16.2 C14.2 61.05,20.7 v60.1,20.7 | C16.2 62.58,20.23 U1.13 | v47.9,2.8 46.49,1.39 v42.5,1.39 | C21.2 64.73,10.62 | 64.73,10.62 C19.2 64.95,11.97 C17.2 65.73,14.18 C9.2 65.82,16.5 v67,16.5 | v62.28,7.11 64.73,9.56 64.73,10.62 | v66.2,6.5 62.89,6.5 v62.28,7.11 | v34.2,11.4 34.3,11.5 v37.5,11.5 | v28.71,22.71 25.96,22.71 JP3.5 | v62.2,19.3 62.2,20.61 C16.2 | v55.8,20.2 v55.8,22.8 53.63,24.97 52.7,24.97 52.01,25.66 v52.01,27.21 | v36.98,29.68 36.88,29.78 32.08,29.78 v29.5,27.2 | v44.57,27.53 45.19,28.15 R13.1 46.19,29.99 46.8,30.6 v46.8,32.3
  pour Top: 18.4,35.9 18.4,-1.3 72,-1.6 71.8,38.2
  pour Bottom: 18.3,36.8 18.3,-1.7 76.1,-3.7 75,40.3 18.4,36.8 18.4,36.9
GND_PWR  (via drill 0.35)
  Top 0.152: 12.24,3.93 LED1.C 13.22,1.82 v13.2,1.8 | 12.24,3.93 JP2.2 | v6.3,31.2 v6.3,32.3 v6.3,33.3 6.41,33.19 7.59,33.19 | v8.5,31.7 v9.5,31.7 v10.5,31.7 v11.5,31.7 v12.6,31.7 12.9,32 v12.9,33.3 | v14.6,33.4 14.33,33.13 14.33,31.87 | v11.3,11.6 v12.7,11.6 13.4,12.3 v13.4,12.6 14,13.2 v14,13.6 14.3,13.9 v15.1,13.9 15.5,13.9 v16.1,14.5 16.7,15.1 v16.7,15.5 16.1,16.1 v15.8,16.1 16.4,16.7 v16.7,16.7 v16.7,17.9 16.6,18 v16.6,19.1 16.6,20.2 v16.7,20.3 | v14.2,22 14.4,21.8 v15.4,21.8 | v8.5,4.3 8,3.8 v8,3.5 7.5,4 v7.5,4.3 7.04,3.83 v7.04,3.5 | v7.04,3.5 6.5,4.03 v6.5,4.3 | v7.04,3.5 7.1,3.43 7.1,2.75 7.1,2 v7.2,1.9 v8.3,1.9 v9.4,1.9 v10.4,1.9 v11.4,1.9 | v14.3,3.2 13.5,4 v13.5,4.1 13.33,3.93 12.24,3.93 | XA2.2 3.97,1.5 v3.6,1.5 2.8,1.5 v2.6,1.7 v1.6,1.7 v1.6,2.7 v2.6,2.7 v2.6,3.8 | v2.6,3.8 v1.6,3.8 | v2.6,3.8 2.9,4.1 v3.5,4.1 | v4.4,24.3 4.5,24.3
  Top 0.305: v14.2,22 12.28,20.08 IC2.10
  Top 0.406: C1.2 8.61,23.41 IC2.2 | C4.2 C3.2 4.1,23.9 4.5,24.3 C2.2 6.2,23.97 C1.2 | C1.2 8.05,26.3 | 8.05,26.3 8.05,28.92 XA1.2 7.59,33.19 8.18,33.78 12.42,33.78 v12.9,33.3 14.33,31.87 JP1.2 | XA2.2 7.1,2.75 9.82,2.75 JP2.2 | 8.05,26.3 7.45,25.7 v6.6,25.7 v4.2,25.7 | v15.8,16.1 15.51,15.8 C7.2
  Bottom 0.152: v1.6,29.1 v2.6,29.1 v3.6,29.1 v3.6,28.1 v2.6,28.1 v1.6,28.1 v1.6,27.1 v2.6,27.1 3,26.7 v3.5,26.7 2.9,26.1 v2.6,26.1 v1.6,26.1 v1.6,25.1 v2.6,25.1 2.9,24.8 v3.5,24.8 2.8,24.1 v2.6,24.1 v1.6,24.1 v1.6,23.1 v2.6,23.1 3.1,22.6 v3.1,22.2 3.7,22.8 v4,22.8 3.5,23.3 v3.5,23.6 4.2,24.3 v4.4,24.3 | v6.6,25.7 6.2,26.1 v6.2,26.6 v7.2,26.6 7.7,26.1 v7.7,25.7 8.2,26.2 v8.2,26.6
  Bottom 0.406: v4.2,25.7 7.47,22.43 7.6,22.43 8.04,22 v14.2,22 16.7,22 v16.7,21.5 v16.7,20.3 v16.7,17.9 16.7,17 v15.8,16.1 15.8,13.89 9.12,7.21 9.12,6.01 11,4.13 JP2.2
  pour Top: -3.4,37 17.7,37 18,36.4 17.8,35.4 17.8,31 9.3,31 9,30.7 8.7,26.5 8.7,22.4 7.1,22.4 7.1,23.5 6.8,23.8 5.2,23.8 4.9,23.5 4.9,19.6 4.6,19.4 -1,19.4 -3.4,36.9
  pour Top: -0.9,4.8 13.4,4.8 15.2,3.1 15.2,-0.6 -1.3,-1.6 -1,4.7
  pour Bottom: -2.7,36.6 17.8,36.1 17.8,31 9.2,30.9 8.9,22.38 9.4,22 17.7,22 17.9,-0.9 -3.2,-0.8 -3.1,4.7 -0.88,4.78 9.08,4.89 9.08,13.05 10.6,14.6 10.6,19.5 16.1,19.5 16.1,21.4 8.5,21.4 6.1,23.7 5.4,23.7 5,23.4 5,19.5 -2.7,19.5
  pour Top: 10.5,12 12.6,12 12.6,16.6 15.2,16.6 15.2,19.4 16,19.4 16,21.1 15.8,21.3 15,21.3 14.8,21.5 13.7,21.5 13.7,22.27 17.8,22.27 17.8,10.7 10.5,10.88
IMURX  (via drill 0.35)
  Top 0.152: IC1.19 67.85,27.75 v67.98,27.62
  Bottom 0.152: v67.98,27.62 67.98,22.28 67.88,22.18 U1.5
IMUTX  (via drill 0.35)
  Top 0.152: v67.28,28.91 66.6,28.91 IC1.20
  Bottom 0.152: U1.4 67.28,24.1 v67.28,28.91
JCLK  (via drill 0.35)
  Top 0.152: IC3.37 43.38,22.04 43.64,22.04 v43.85,22.25
  Bottom 0.152: v43.85,22.25 43.85,25.15 49.74,31.04 51.05,32.42 JP4.1
JDATA  (via drill 0.35)
  Top 0.152: IC3.34 43.55,16.98 v43.7,16.98
  Bottom 0.152: v43.7,16.98 47.71,20.98 47.71,26.11 52.1,30.6 54.6,30.6 JP4.3
MA1
  Top 0.152: IC4.16 34,13.13 34,16.2 IC3.19
MA2
  Top 0.152: IC4.15 36.44,10.03 35.86,10.03 35.7,10.19 35.7,11 33.7,13 33.7,16.32 33.7,16.33 33.7,16.6 IC3.18
MB1  (via drill 0.35)
  Top 0.152: IC3.16 32.5,16.82 v32.5,12.3 | v36.4,4.9 36.69,5.19 IC4.9
  Bottom 0.152: v36.4,4.9 36.37,4.93 33.7,4.93 32.5,6.13 v32.5,12.3
MB2  (via drill 0.35)
  Top 0.152: IC3.17 33.19,16.8 v33.19,11.3 | v38.4,5.8 37.68,6.52 IC4.10
  Bottom 0.152: v33.19,11.3 33.19,6.71 34.2,5.7 38.3,5.7 v38.4,5.8
MSLP  (via drill 0.35)
  Top 0.152: v41.27,25.73 41.27,25.58 IC3.45 | v30,12.5 30,11.29 IC4.1
  Bottom 0.152: v41.27,25.73 41.3,25.7 38.9,23.3 38.9,16.5 35.4,13 30.4,13 30,12.6 v30,12.5
N$1
  Top 0.152: IC3.5 33.9,25.21 33.9,26.49 Y1.3
N$2
  Top 0.152: IC3.6 33.5,24.9 32.09,24.9 Y1.1
N$3
  Top 0.152: R19.1 JP6.2
N$4
  Top 0.152: R21.1 LED4.C
N$5
  Top 0.152: IC3.32 43.31,15.8 50.5,15.8 50.58,15.8 52.74,15.8 58.86,9.68 R14.2
N$6
  Top 0.152: R15.2 59.91,8.86 R16.1 52.67,16.3 43.52,16.3 IC3.33
N$7
  Top 0.152: R20.1 JP7.2
N$8
  Top 0.152: IC3.2 35.22,26.01 LED2.C
N$9
  Top 0.406: IC4.2 30.02,9.78 29.6,10.2 29.6,10.9 29.3,11.2 X1.1
N$11
  Top 0.406: IC4.4 29.22,8.48 28.32,9.38 X1.2
N$12
  Top 0.406: IC4.5 30.83,7.8 29.3,7.8 28.32,6.83 X2.1
N$13
  Top 0.406: IC4.7 30.82,6.5 29.7,6.5 29.6,6.4 29.6,5.7 29.1,5.2 X2.2
N$14
  Top 0.406: IC4.14 38.34,9.12 C30.1
N$15
  Top 0.152: IC4.11 36.72,7.21
  Top 0.406: IC4.11 36.72,7.21 C29.2
N$16
  Top 0.406: LED3.A 55.69,4.12 R17.1
N$17  (via drill 0.35)
  Top 0.152: IC3.11 33.7,21.17 33.7,20.4 v31.6,20.4
  Bottom 0.152: v31.6,20.4 26.63,20.4 25.68,19.45 25.68,19.38 25.3,19 25.3,17.5 24.6,16.8 22,16.8 21.59,16.39 JP3.2
N$18  (via drill 0.35)
  Top 0.152: IC3.12 32.06,22.1 v31.4,22.1
  Bottom 0.152: v31.4,22.1 27.3,22.1 24.53,19.33 23.72,19.33 22.73,18.34 JP3.4
N$19  (via drill 0.35)
  Top 0.152: JP3.6 22.73,20.88 23.72,19.89 25.6,19.89 v26.29,19.2 | v31.6,18.51 32.07,18.51 IC3.13
  Bottom 0.152: v26.29,19.2 26.98,18.51 v31.6,18.51
N$20
  Top 0.152: C6.1 63.21,25.4 IC1.9
N$21
  Top 0.152: IC1.5 60.7,26.25 R1.1
N$23
  Bottom 0.152: C9.1 U1.10
N$26  (via drill 0.35)
  Top 0.152: v65.72,24.23 65.72,21.52 64.85,20.65 R6.2
  Bottom 0.152: U1.3 65.72,23.21 v65.72,24.23
N$27
  Top 0.305: R4.1 11.05,20.58 IC2.11
N$28  (via drill 0.35)
  Top 0.305: 7.17,21.57 IC2.3
  Top 0.406: 7.17,21.57 v7.17,21.73 | v15.3,20.3 14.35,20.3 R2.1
  Bottom 0.406: v7.17,21.73 8.6,20.3 v15.3,20.3
N$29  (via drill 0.35)
  Top 0.254: IC2.6 7.66,19.28
  Top 0.305: v7.6,18.8 7.6,19.22 7.66,19.28
  Top 0.406: v6.1,21.4 5.87,21.63 C2.1
  Bottom 0.406: v7.6,18.8 6.1,20.3 v6.1,21.4
N$30
  Top 0.305: 10.37,18.36 9.61,19.12 IC2.8
  Top 0.406: 10.37,18.36 R5.1
N$31
  Top 0.406: C5.1 R5.2
N$32
  Top 0.305: 9.11,18.93 IC2.7
  Top 0.406: C5.2 11.15,12.85 L1.2 9.11,13.17 9.11,18.93
N$33
  Top 0.305: IC2.9 13.77,19.58
  Top 0.406: 13.77,19.58 R2.2 C7.1
N$37
  Top 0.152: LED1.A 15.9,1.77 R3.1
N$40
  Top 0.152: Q1.P1 25.82,30.21 25.86,30.16 | 25.86,30.16 R7.2 | R8.2 25.87,30.17 25.86,30.16
N$41
  Top 0.152: R10.2 21.22,28.55 Q2.P3
N$46
  Top 0.152: Q2.P1 19.53,31.03 R9.1 22.16,31.16 Q1.P3
NRST  (via drill 0.35)
  Top 0.152: IC3.7 33.5,24.2 v33.1,24.2 | v37.71,29.1 38.64,29.1 38.65,29.11 41.75,29.11 41.76,29.1 55.71,29.1 R18.1 58.06,29.36 v58.1,29.4
  Bottom 0.152: v33.1,24.2 37.71,28.81 v37.71,29.1 | v58.1,29.4 58.4,29.7 58.4,31.7 58.96,32.26 JP4.4
PB10  (via drill 0.35)
  Top 0.152: JP3.7 27.2,20.35 27.2,18.8 29.21,16.79 v31.6,16.79 | v34.61,15.3 35.45,16.14 IC3.21
  Bottom 0.152: v31.6,16.79 33.11,16.79 v34.61,15.3
PB11  (via drill 0.35)
  Top 0.152: JP3.8 22.61,22.4 24.6,22.4 26.89,20.11 26.89,18.67 29.38,16.19 v30.92,16.19 | v35.2,14.5 35.3,14.6 35.3,15.38 IC3.22
  Bottom 0.152: v30.92,16.19 32.03,16.19 32.15,16.31 32.74,16.31 34.35,14.69 35.01,14.69 v35.2,14.5
TRIG_SONAR  (via drill 0.35)
  Top 0.152: IC3.41 41.88,23.37 v42.7,23.37 | v38.9,28.5 v41.5,28.5
  Bottom 0.152: v41.5,28.5 41.9,28.1 41.9,26.75 43.07,25.58 43.07,23.73 v42.7,23.37 | JP5.2 38.33,29.07 v38.9,28.5
USB1D+
  Top 0.152: X3.3 R15.1
USB1D-
  Top 0.152: X3.2 58.86,4.56 R14.1
USB2D+  (via drill 0.35)
  Top 0.152: X3.7 63.9,5.6 63.99,5.7 64.63,5.7 65,6.07 65,6.11 65.31,6.41 65.31,6.9 66.1,7.69 66.1,14.5 v64.4,16.2
  Bottom 0.152: v64.4,16.2 64.4,19.18 U1.12
USB2D-  (via drill 0.35)
  Top 0.152: v64.7,15 64.7,7.03 62.9,5.22 X3.6
  Bottom 0.152: v64.7,15 65.08,15.38 65.08,15.94 65.05,15.97 65.05,18.16 65.08,18.18 U1.11
VIN  (via drill 0.35)
  Top 0.152: C15.1 19.59,32.43 | 19.59,32.43 R9.2 | Q2.P2 19.18,29.33 | 19.18,29.33 18.5,30.01 18.5,31.9 19.03,32.43 19.59,32.43 | JP1.1 19.18,29.33 | v11,22.8 9.94,23.86 9.84,23.86 | v9.9,26.6 9.84,26.66 9.84,27.67
  Top 0.406: C1.1 9.84,23.86 9.61,23.63 IC2.1
  Top 1.27: 9.84,23.86 9.84,27.67 XA1.1 16.15,29.38 JP1.1 | C1.1 10.36,23.56 R4.2
  Bottom 0.152: v9.9,26.6 10.3,26.2 v10.3,25.8 10.9,26.4 v10.9,26.6 11.4,26.1 v11.4,25.8 11.9,26.3 v11.9,26.6 12.4,26.1 v12.4,25.8 12.9,26.3 v12.9,26.6 13.4,26.1 v13.4,25.8 | v13.4,25.8 14,26.4 v14,26.6 v15,26.6 15.2,26.4 v16.2,26.4 v17.2,26.4 | v17.2,26.4 v17.2,27.5 | v17.2,26.4 v17.2,25.3 v16.2,25.3 15.8,24.9 v15.3,24.9 14.7,24.3 v14.4,24.3 15,23.7 v15.3,23.7 14.6,23 v14.5,23 14.6,23.1 v16.2,23.1 v17.2,23.1 v17.2,24.2 v16.2,24.2 | v13.4,25.8 12.9,25.3 v12.9,25
  pour Top: 9.5,30.6 17.8,30.6 17.8,22.6 9.2,22.6 9.2,28.3
  pour Bottom: 9.64,30.6 9.35,22.67 9.47,22.5 10,22.5 17.8,22.5 17.9,30.6
  pour Top: 9.2,23.8 9.2,21.6 10.7,21.6 11.4,22.5
VM
  Top 0.406: X3.5 61.56,4.18 61.56,3.6 61.21,3.26 55.85,3.26 54.5,1.9 43.3,1.9 42.2,3 42.2,4 41.6,4.6 C18.+ | C20.1 37.07,3.35 C22.1 39.65,4.6 C18.+ | C18.+ 40.65,6.22 C29.1 39.66,7.54 39.18,8.02 37.64,8.02 37.58,7.95 37.02,7.95 36.89,7.82 IC4.12
VOUT  (via drill 0.35)
  Top 0.152: R3.2 18.68,2.62 18.39,2.91 16.18,2.91 12.62,6.47 JP2.1 | v5.8,18.4 5.8,18.7 5.79,18.71
  Top 0.406: 6.68,20.08 IC2.5
  Top 0.61: 6.68,20.08 6.4,19.8
  Top 1.27: 5.79,18.71 5.79,19.19 6.4,19.8 | JP2.1 10.76,6.71 XA2.1 3.09,8.84 L1.1 2,13.94 v2,15 C4.1 C3.1 4.65,17.4 v5.9,17.4 5.8,17.5 v5.8,18.4
  Bottom 0.152: v2,15 2,15.4 v1.5,15.9 v2.5,15.9 v3.5,15.9 v4.4,15.9 5,15.3 5.1,15.3 | v5.2,14.3 5.1,14.4 5.1,15.3 | v5.2,14.3 v6.2,14.3 v6.2,15.3 5.6,15.9 v5.6,16.3 6.2,16.3 v6.5,16.6 v7.4,16.6 v7.4,17.5 7.2,17.5 v6.6,18.1 v5.9,17.4 | v5.2,13.3 5.2,13.4 | 5.2,13.4 v5.2,14.3 | 5.2,13.4 6.1,13.4 v6.2,13.3 v6.2,12.3 v5.2,12.3 v5.2,11.3 v6.2,11.3 v6.2,10.3 v5.2,10.3 v4.2,10.3 4.1,10.2 v2.7,10.2 v1.5,10.2 v1.5,9.2 | v1.5,9.2 v2.5,9.2 v3.5,9.2 v4.6,9.2 v5.7,9.2 v7.1,9.2 v8.1,9.2 v8.1,8.2 v8.1,7.2 v8.1,5.9 | v1.5,6.6 2,6.1 v2,5.8 v3,5.8 2.5,6.3 v2.5,6.6 3,7.1 v3,7.4 v2,7.4 2.5,7.9 v2.5,8.2 v1.5,8.2 v1.5,9.2 | v5.2,15.3 5.1,15.3
  pour Top: -1.3,18.8 6.3,18.8 7.8,17.8 7.8,15.8 6.8,14.4 6.8,11 7.3,10.5 13.5,10.5 13.5,5.21 -4.1,5.21 -1.3,18.7
  pour Bottom: -1.8,19.1 5.6,19.1 5.6,20 6.9,18.8 6.9,18.2 8.5,17.3 8.6,5.2 -4.1,5.2 -1.9,19
W_LED
  Top 0.152: IC3.31 42.75,15.65 R21.2

### Text on the board
tPlace: - | +5V TRIG ECHO GND | JCLK GND JDATA NRST | VIN | + | - | + | reV.F. | SENGI | L | L | VOUT | + | GBr1 2019 | R | R | - | ERWHI
bPlace: SENGI | designed by / G. Bruno | ERWHI | GBr1 2019
tNames: PA1 PA2 PA3 PB11 | +5V +3V3 GND PB10